# Altium schematic sheet DaughterBoard.SchDoc: 3D Printer Daughterboard
size Letter; DrawnBy: Sean & Zika; Revision: 1.0; SheetNumber: 2; SheetTotal: 2
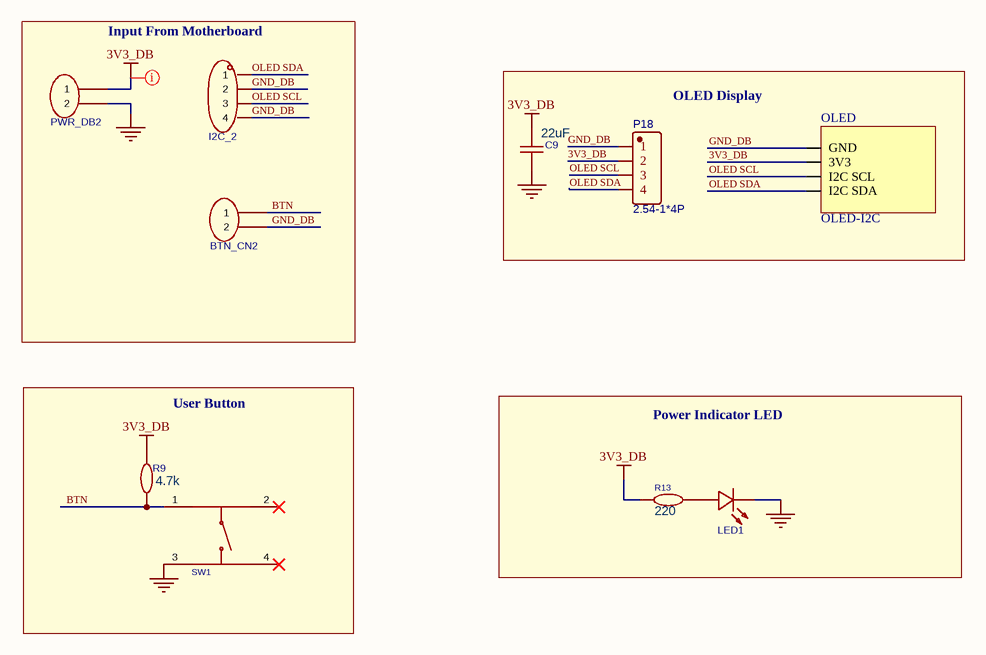
[diagram p0: DaughterBoard.SchDoc]

## Parts
BTN_CN2  wj127-5.0-02p-14-00a  [Screw-Terminal-2P]  (value not drawn)
C9  22uF  [Capacitor-22uF-0805]
I2C_2  wj127-5.0-04p-14-00a  [Screw-Terminal-4P]  (value not drawn)
LED1  ncd0805r1_c84256  [RED-LED-0805]  (value not drawn)
OLED  OLED-I2C  [I2C-OLED]  (graphical)
P18  2.54-1*4P  [Female-Header-4P]
PWR_DB2  wj127-5.0-02p-14-00a  [Screw-Terminal-2P]  (value not drawn)
R9  4.7k  [Resistor-4.7k-0805]
R13  220  [Resistor-220-0805]
SW1  ts6685h-250gf  [Tactile-SPST-Long]  (value not drawn)

## Blocks framed on the sheet
Input From Motherboard: BTN_CN2 I2C_2 PWR_DB2
OLED Display: C9 OLED P18
User Button: R9 SW1
Power Indicator LED: LED1 R13

## Nets
3V3_DB: C9.1 OLED.2(3V3) P18.2 PWR_DB2.1 R9.2 R13.1
GND_DB: BTN_CN2.2 C9.2 I2C_2.2 I2C_2.4 LED1.1(-) OLED.1(GND) P18.1 PWR_DB2.2 SW1.3
BTN: BTN_CN2.1 R9.1 SW1.1
OLED SCL: I2C_2.3 OLED.3(I2C_SCL) P18.3
OLED SDA: I2C_2.1 OLED.4(I2C_SDA) P18.4
NetLED1_2: LED1.2(+) R13.2

Not connected (* = marked no-connect by the designer): SW1 2* 4*

## Layout directives
net class 3V3-PWR; rule Width Constraint [Pref Width = 20mil    Min Width = 20mil    Max Width = 20mil]: 3V3_DB

## Library data of the parts
BTN_CN2 PWR_DB2 = Screw-Terminal-2P: Number of Positions or Pins:1x2P Pitch:5mm Color:Green Mounting Type:Through Hole Number of Pins:2P Number of Rows:1 Number of PINs Per Row:2 Screw Specification:M2.5 Current Rating:15A Voltage Rating (Max):250V Wire Gauge - AWG:14~26 Wire Gauge - mm2:1.5; Manufacturer: KANGNEX(康奈克斯电气); Symbol: WJ127-5.0-2P; AddInBom: yes; ModelId: 0c699dafc1fb4759bdee4490ad46ecba; ModelName: CONN-TH_2P-P5.00_CPC3703CTR; ModelTransform: 416.145,318.897,0,0,0,0,-11.811,5.315,-149.606; Number of Positions or Pins: 1x2P; Pitch: 5mm; Number of PINs Per Row: 2; Screw Specification: M2.5; Current Rating: 15A; Voltage Rating (Max): 250V; Wire Gauge - AWG: 14~26; Wire Gauge - mm2: 1.5; LCSC Part Name: 1x2P 5mm 直插 排数:1 每排P数:2; SupplierPart: C3703; ManufacturerPart: WJ127-5.0-02P-14-00A; Supplier Footprint: 插件,P=5mm; JLCPCB Part Class: Extended Part; Datasheet: https://item.szlcsc.com/datasheet/WJ127-5.0-02P-14-00A/4105.html; Supplier: LCSC; ConvertToPcb: yes; FootprintName: CONN-TH_2P-P5.00_CPC3703CTR; Color: Green; Mounting Type: Through Hole; Number of Pins: 2P; Number of Rows: 1; Operating Temperature: -40℃~+105℃; Height Above Board: 10.14mm
C9 = Capacitor-22uF-0805: Capacitance:22uF Tolerance:±20% Tolerance:±20% Voltage Rating:10V Temperature Coefficient:X5R; Manufacturer: SAMSUNG(三星); Symbol: CL21A226MPQNNNE; AddInBom: yes; ModelId: 8c88e81f49c6409b980720ec8953afb6; ModelName: C0805_L2.0-W1.3-H1.3; ModelTransform: 78.74,51.181,0,0,0,0,0,0.0005,0; Tolerance: ±20%; Voltage Rating: 10V; Temperature Coefficient: X5R; LCSC Part Name: 22uF ±20% 10V; SupplierPart: C29277; ManufacturerPart: CL21A226MPQNNNE; Supplier Footprint: 0805; JLCPCB Part Class: Extended Part; Datasheet: https://item.szlcsc.com/datasheet/CL21A226MPQNNNE/30029.html; Supplier: LCSC; ConvertToPcb: yes; FootprintName: C0805; Value: 22uF
I2C_2 = Screw-Terminal-4P: Number of Positions or Pins:1x4P Pitch:5mm Color:Green Mounting Type:Through Hole Number of Pins:4P Number of Rows:1 Number of PINs Per Row:4 Screw Specification:M2.5 Current Rating:15A Voltage Rating (Max):250V Wire Gauge - AWG:14~26 Wire Gauge - mm2:1.5; Manufacturer: KANGNEX(康奈克斯电气); Symbol: WJ127-5.0-4P; AddInBom: yes; ModelId: 30be887f740a4f6bacb9c64f3bb40a03; ModelName: CONN-TH_WJ5.00-LI-4P-127; ModelTransform: 807.0748,318.897,0,0,0,0,-9.843,7.874,-157.48; Number of Positions or Pins: 1x4P; Pitch: 5mm; Number of PINs Per Row: 4; Screw Specification: M2.5; Current Rating: 15A; Voltage Rating (Max): 250V; Wire Gauge - AWG: 14~26; Wire Gauge - mm2: 1.5; LCSC Part Name: 1x4P 5mm 直插 排数:1 每排P数:4; SupplierPart: C192779; ManufacturerPart: WJ127-5.0-04P-14-00A; Supplier Footprint: 插件,P=5mm; JLCPCB Part Class: Extended Part; Datasheet: https://item.szlcsc.com/datasheet/WJ127-5.0-04P-14-00A/225182.html; Supplier: LCSC; ConvertToPcb: yes; FootprintName: CONN-TH_4P-P5.00_WJ127-5.0-4P; Color: Green; Mounting Type: Through Hole; Number of Pins: 4P; Number of Rows: 1; Operating Temperature: -40℃~+105℃; Height Above Board: 10.14mm
LED1 = RED-LED-0805: Lamp Holder Type:- Illumination Color:Red Voltage - Forward(Vf):1.6V~2.6V Voltage - Forward(Vf):1.6V~2.6V Power(Watts):65mW Test Current:25mA Wavelength - Dominant:615nm~630nm Wavelength - Dominant:615nm~630nm Peak Wavelength:630nm Peak Wavelength:630nm D; Manufacturer: 国星光电; Symbol: FC-2012HRK-620D; AddInBom: yes; ModelId: 23093642268545519703b953fc993978; ModelName: LED0805-RD; ModelTransform: 79.527,49.2125,0,0,0,0,0,0,0; Illumination Color: Red; Power(Watts): 65mW; Test Current: 25mA; Peak Wavelength: 630nm; Diode Configuration: Discrete Diode; Luminous Intensity: 195mcd; Viewing Angle: 130°; Half wave width: 15nm; LCSC Part Name: 片式发光二极管; SupplierPart: C84256; ManufacturerPart: NCD0805R1; Supplier Footprint: 0805; JLCPCB Part Class: Basic Part; Datasheet: https://item.szlcsc.com/datasheet/NCD0805R1/85425.html; Supplier: LCSC; ConvertToPcb: yes; FootprintName: LED0805-RD; Lamp Holder Type: -; Voltage - Forward(Vf): 1.6V~2.6V; Wavelength - Dominant: 615nm~630nm; Lens Color: -; Color Temperature: -; Mounting Style: Top-mount; Operating Temperature: -30℃~+85℃; Emitting Material: -; Lumens: -; ESD Withstand Voltage: -
P18 = Female-Header-4P: Manufacturer: BOOMELE(博穆精密); Manufacturer Part: 2.54-1*4P母; Contributor: LCSC; Supplier: LCSC; SupplierPart: C2718488; JLCPCB Part Class: Extended Part; spicePre: H; spiceSymbolName: 2.54-1*4P母
R9 = Resistor-4.7k-0805: Type:Thick Film Resistors Resistance:4.7kΩ Tolerance:±1% Tolerance:±1% Power(Watts): Overload Voltage (Max): Temperature Coefficient:±100ppm/℃ Temperature Coefficient:±100ppm/℃ Operating Temperature Range:-55℃~+155℃ Operating Temperature Range:-55℃~+155℃; Manufacturer: UNI-ROYAL(厚声); Symbol: 0805W8F4701T5E; AddInBom: yes; ModelId: b83c7c5430874b8eb2319a65d9433429; ModelName: R0805_L2.0-W1.3-H0.6; ModelTransform: 78.74,51.181,0,0,0,0,0,-0.0005,0; Value: 4.7kΩ; Tolerance: ±1%; LCSC Part Name: 4.7kΩ ±1% 125mW 厚膜电阻; SupplierPart: C17673; ManufacturerPart: 0805W8F4701T5E; Supplier Footprint: 0805; JLCPCB Part Class: Basic Part; Datasheet: https://atta.szlcsc.com/upload/public/pdf/source/20200306/C422600_1E6D84923E4A46A82E41ADD87F860B5C.pdf; Supplier: LCSC; ConvertToPcb: yes; FootprintName: R0805; Type: Thick Film Resistors; Temperature Coefficient: ±100ppm/℃; Operating Temperature Range: -55℃~+155℃
R13 = Resistor-220-0805: Type:Thick Film Resistor Resistance:220Ω Tolerance:±1% Tolerance:±1% Power(Watts):125mW Voltage-Supply(Max):150V Temperature Coefficient:±100ppm/℃ Temperature Coefficient:±100ppm/℃ Operating Temperature:-55℃~+155℃ Operating Temperature:-55℃~+155℃; Manufacturer: UNI-ROYAL(厚声); Symbol: 0805W8F2200T5E; Value: 220Ω; AddInBom: yes; ModelId: b83c7c5430874b8eb2319a65d9433429; ModelName: R0805_L2.0-W1.3-H0.6; ModelTransform: 78.74,51.181,0,0,0,0,0,-0.0005,0; Tolerance: ±1%; Power(Watts): 125mW; Voltage-Supply(Max): 150V; Supplier: LCSC; Manufacturer Part: 0805W8F2200T5E; SupplierPart: C17557; JLCPCB Part Class: Basic Part; LCSC Part Name: 厚膜电阻 220Ω ±1%; Supplier Footprint: 0805; Datasheet: https://item.szlcsc.com/datasheet/0805W8F2200T5E/18245.html; ConvertToPcb: yes; FootprintName: R0805; Type: Thick Film Resistor; Temperature Coefficient: ±100ppm/℃; Operating Temperature: -55℃~+155℃
SW1 = Tactile-SPST-Long: Circuit:SPST Actuator Style:Round Button Operating Force:2.5N Mounting Type:Through Hole Length:6mm Width:6mm Switch Height:8.5mm Contact Current:50mA Voltage Rating:12V With Lamp:- Life:-; Manufacturer: YE; Symbol: C13828; AddInBom: yes; ModelId: 1b2aa19db9484d8f9f922c3504714525; ModelName: SW-TH_4P-L6.0-W6.0-H5.0-LS6.5-P4.50; ModelTransform: 236.22,323.03,0,90,0,0,0,0,-137.795; Circuit: SPST; Operating Force: 2.5N; Switch Height: 8.5mm; Contact Current: 50mA; Voltage Rating: 12V; Supplier: LCSC; SupplierPart: C13828; Manufacturer Part: TS6685H-250gf; JLCPCB Part Class: Extended Part; LCSC Part Name: 6*6*8.5mm 直插 轻触开关; Supplier Footprint: 插件; Datasheet: https://item.szlcsc.com/datasheet/TS6685H-250gf/14483.html; ConvertToPcb: yes; FootprintName: SW-TH_4P-L6.0-W6.0-P4.50-LS6.5; Actuator Style: Round Button; Mounting Type: Through Hole; Length: 6mm; Width: 6mm; With Lamp: -; Life: -